# Altium schematic sheet 13-SoC POWER3.SchDoc
size 513 x 386 mm
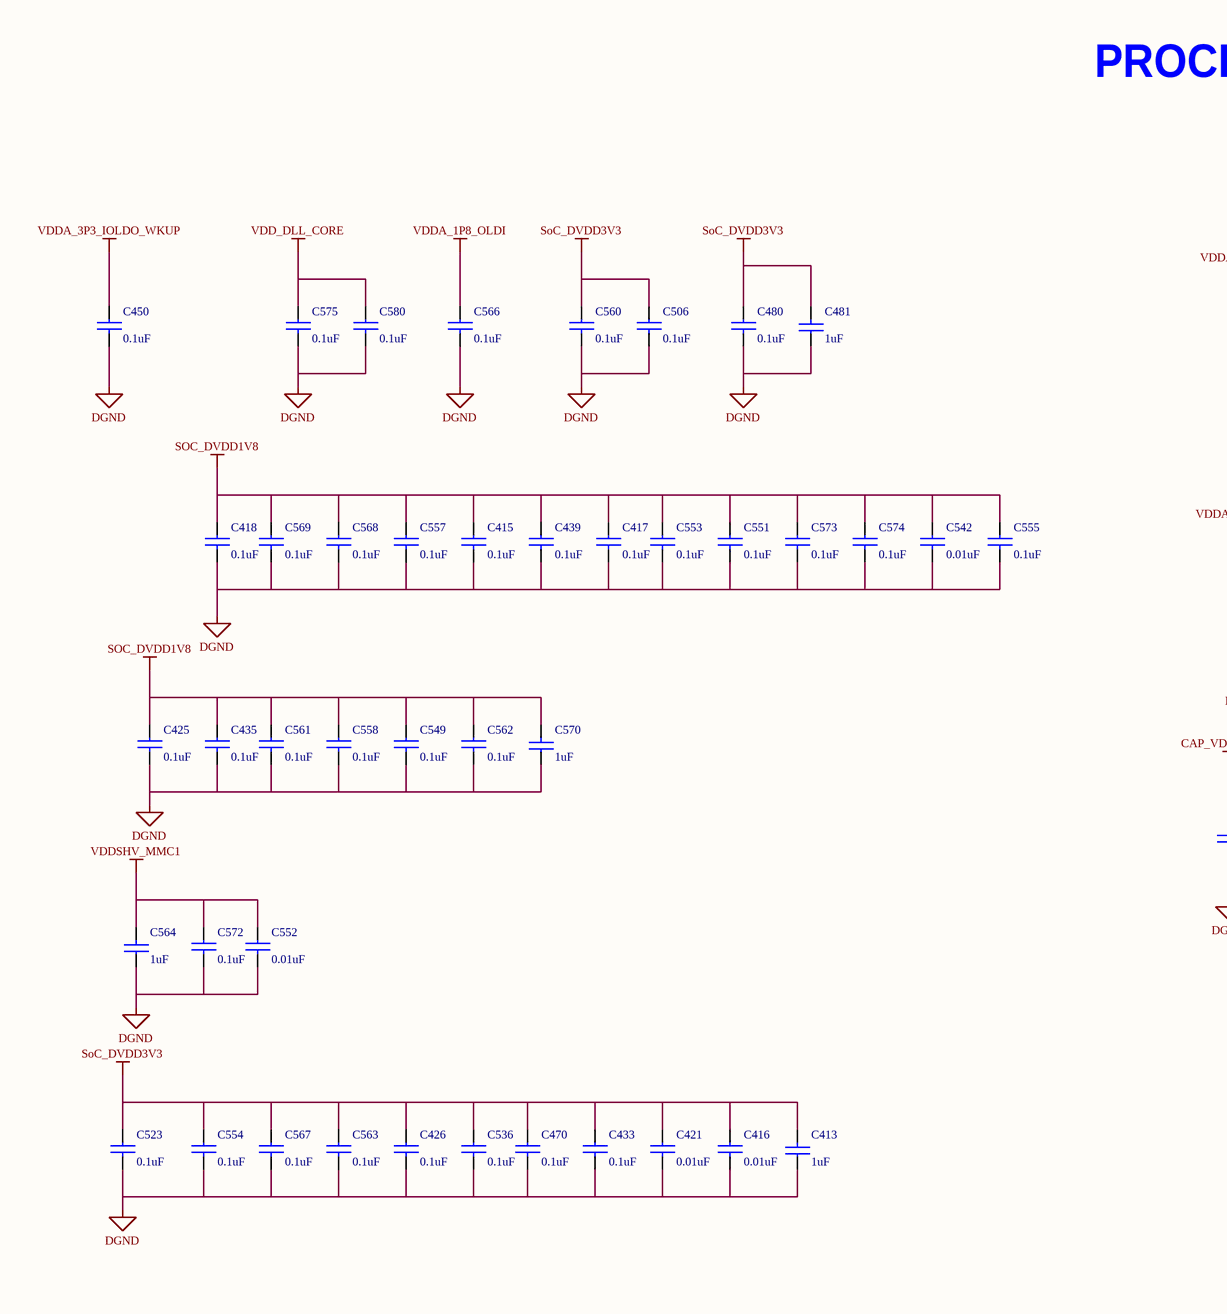
[diagram p0: 13-SoC POWER3.SchDoc, left]
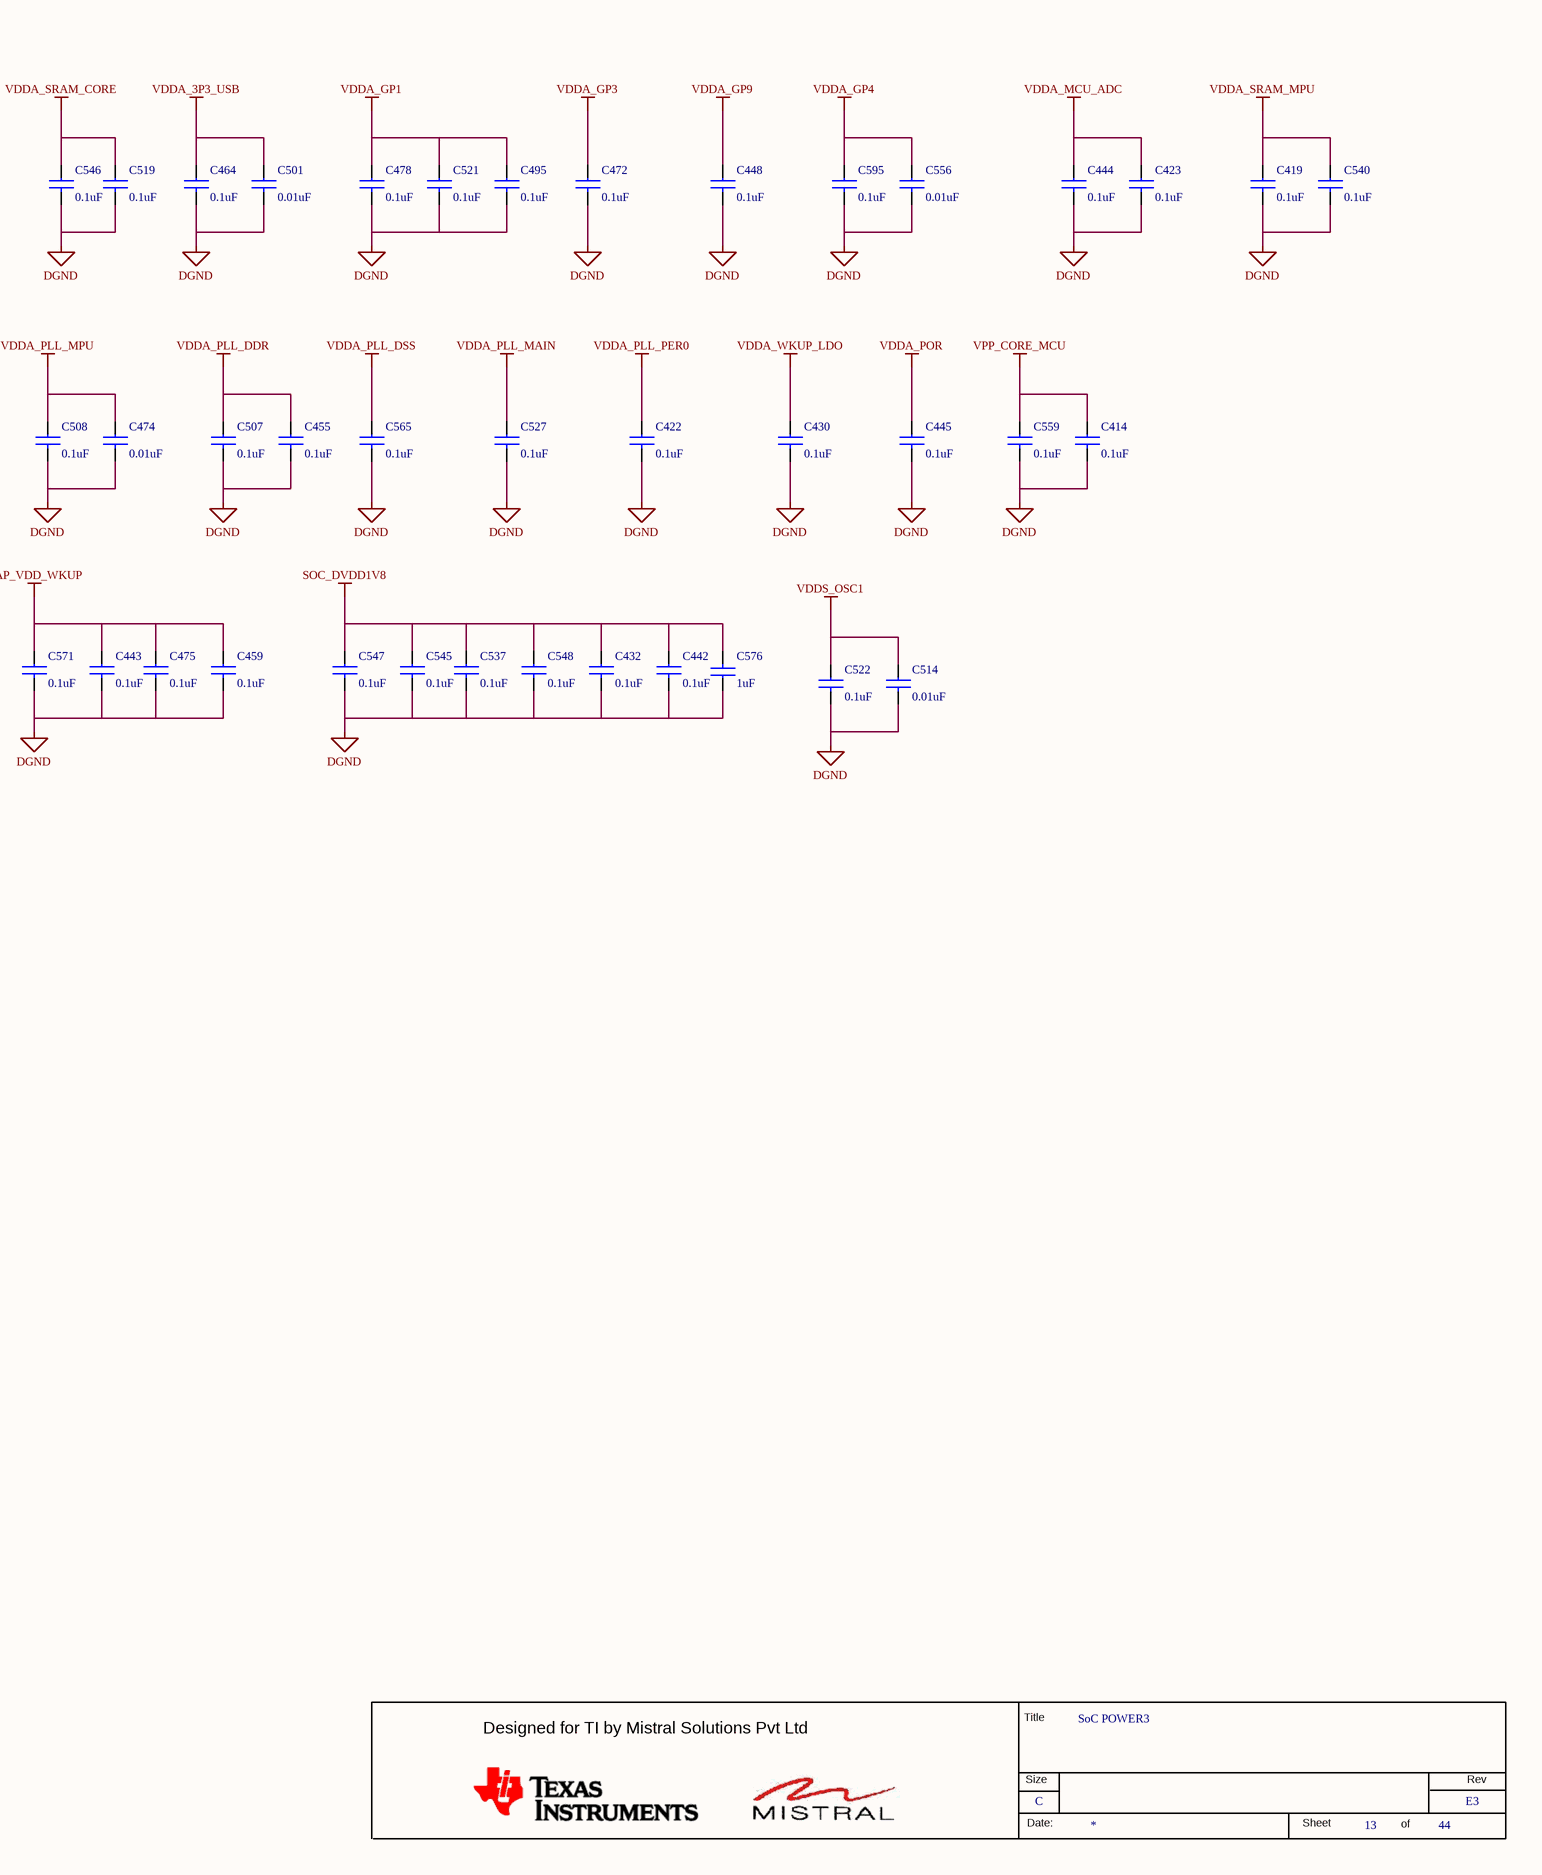
[diagram p1: 13-SoC POWER3.SchDoc, right]

## Parts
*  RevCode: E3  Title: SoC POWER3  Page Size: C  Page Number: 13  Page Count: 44  (hidden comment: MISTRAL_TITLEBLK_CSIZE)  (graphical)
C413  1uF  [CAP0402_0-75]
C414  0.1uF  [CAP0201_0-5]
C415  0.1uF  [CAP0201_0-5]
C416  0.01uF  [CAP0201_0-5]
C417  0.1uF  [CAP0201_0-5]
C418  0.1uF  [CAP0201_0-5]
C419  0.1uF  [CAP0201_0-5]
C421  0.01uF  [CAP0201_0-5]
C422  0.1uF  [CAP0201_0-5]
C423  0.1uF  [CAP0201_0-5]
C425  0.1uF  [CAP0201_0-5]
C426  0.1uF  [CAP0201_0-5]
C430  0.1uF  [CAP0201_0-5]
C432  0.1uF  [CAP0201_0-5]
C433  0.1uF  [CAP0201_0-5]
C435  0.1uF  [CAP0201_0-5]
C439  0.1uF  [CAP0201_0-5]
C442  0.1uF  [CAP0201_0-5]
C443  0.1uF  [CAP0201_0-5]
C444  0.1uF  [CAP0201_0-5]
C445  0.1uF  [CAP0201_0-5]
C448  0.1uF  [CAP0201_0-5]
C450  0.1uF  [CAP0201_0-5]
C455  0.1uF  [CAP0201_0-5]
C459  0.1uF  [CAP0201_0-5]
C464  0.1uF  [CAP0201_0-5]
C470  0.1uF  [CAP0201_0-5]
C472  0.1uF  [CAP0201_0-5]
C474  0.01uF  [CAP0201_0-5]
C475  0.1uF  [CAP0201_0-5]
C478  0.1uF  [CAP0201_0-5]
C480  0.1uF  [CAP0201_0-5]
C481  1uF  [CAP0402_0-75]
C495  0.1uF  [CAP0201_0-5]
C501  0.01uF  [CAP0201_0-5]
C506  0.1uF  [CAP0201_0-5]
C507  0.1uF  [CAP0201_0-5]
C508  0.1uF  [CAP0201_0-5]
C514  0.01uF  [CAP0201_0-5]
C519  0.1uF  [CAP0201_0-5]
C521  0.1uF  [CAP0201_0-5]
C522  0.1uF  [CAP0201_0-5]
C523  0.1uF  [CAP0201_0-5]
C527  0.1uF  [CAP0201_0-5]
C536  0.1uF  [CAP0201_0-5]
C537  0.1uF  [CAP0201_0-5]
C540  0.1uF  [CAP0201_0-5]
C542  0.01uF  [CAP0201_0-5]
C545  0.1uF  [CAP0201_0-5]
C546  0.1uF  [CAP0201_0-5]
C547  0.1uF  [CAP0201_0-5]
C548  0.1uF  [CAP0201_0-5]
C549  0.1uF  [CAP0201_0-5]
C551  0.1uF  [CAP0201_0-5]
C552  0.01uF  [CAP0201_0-5]
C553  0.1uF  [CAP0201_0-5]
C554  0.1uF  [CAP0201_0-5]
C555  0.1uF  [CAP0201_0-5]
C556  0.01uF  [CAP0201_0-5]
C557  0.1uF  [CAP0201_0-5]
C558  0.1uF  [CAP0201_0-5]
C559  0.1uF  [CAP0201_0-5]
C560  0.1uF  [CAP0201_0-5]
C561  0.1uF  [CAP0201_0-5]
C562  0.1uF  [CAP0201_0-5]
C563  0.1uF  [CAP0201_0-5]
C564  1uF  [CAP0402_0-75]
C565  0.1uF  [CAP0201_0-5]
C566  0.1uF  [CAP0201_0-5]
C567  0.1uF  [CAP0201_0-5]
C568  0.1uF  [CAP0201_0-5]
C569  0.1uF  [CAP0201_0-5]
C570  1uF  [CAP0402_0-75]
C571  0.1uF  [CAP0201_0-5]
C572  0.1uF  [CAP0201_0-5]
C573  0.1uF  [CAP0201_0-5]
C574  0.1uF  [CAP0201_0-5]
C575  0.1uF  [CAP0201_0-5]
C576  1uF  [CAP0402_0-75]
C580  0.1uF  [CAP0201_0-5]
C595  0.1uF  [CAP0201_0-5]

## Nets
CAP_VDD_WKUP: C443.1 C459.1 C475.1 C571.1
DGND: C413.1 C414.2 C415.2 C416.2 C417.2 C418.2 C419.2 C421.2 C422.2 C423.2 C425.2 C426.2 C430.2 C432.2 C433.2 C435.2 C439.2 C442.2 C443.2 C444.2 C445.2 C448.2 C450.2 C455.2 C459.2 C464.2 C470.2 C472.2 C474.2 C475.2 C478.2 C480.2 C481.1 C495.2 C501.2 C506.2 C507.2 C508.2 C514.2 C519.2 C521.2 C522.2 C523.2 C527.2 C536.2 C537.2 C540.2 C542.2 C545.2 C546.2 C547.2 C548.2 C549.2 C551.2 C552.2 C553.2 C554.2 C555.2 C556.2 C557.2 C558.2 C559.2 C560.2 C561.2 C562.2 C563.2 C564.1 C565.2 C566.2 C567.2 C568.2 C569.2 C570.1 C571.2 C572.2 C573.2 C574.2 C575.2 C576.1 C580.2 C595.2
SOC_DVDD1V8: C415.1 C417.1 C418.1 C425.1 C432.1 C435.1 C439.1 C442.1 C537.1 C542.1 C545.1 C547.1 C548.1 C549.1 C551.1 C553.1 C555.1 C557.1 C558.1 C561.1 C562.1 C568.1 C569.1 C570.2 C573.1 C574.1 C576.2
SoC_DVDD3V3: C413.2 C416.1 C421.1 C426.1 C433.1 C470.1 C480.1 C481.2 C506.1 C523.1 C536.1 C554.1 C560.1 C563.1 C567.1
VDD_DLL_CORE: C575.1 C580.1
VDDA_1P8_OLDI: C566.1
VDDA_3P3_IOLDO_WKUP: C450.1
VDDA_3P3_USB: C464.1 C501.1
VDDA_GP1: C478.1 C495.1 C521.1
VDDA_GP3: C472.1
VDDA_GP4: C556.1 C595.1
VDDA_GP9: C448.1
VDDA_MCU_ADC: C423.1 C444.1
VDDA_PLL_DDR: C455.1 C507.1
VDDA_PLL_DSS: C565.1
VDDA_PLL_MAIN: C527.1
VDDA_PLL_MPU: C474.1 C508.1
VDDA_PLL_PER0: C422.1
VDDA_POR: C445.1
VDDA_SRAM_CORE: C519.1 C546.1
VDDA_SRAM_MPU: C419.1 C540.1
VDDA_WKUP_LDO: C430.1
VDDS_OSC1: C514.1 C522.1
VDDSHV_MMC1: C552.1 C564.2 C572.1
VPP_CORE_MCU: C414.1 C559.1

## Notes on the sheet
- PROCESSOR DECAPS
- (in symbol MISTRAL_TITLEBLK_CSIZE) Title; Designed for TI by Mistral Solutions Pvt Ltd; Size; Rev; Date:; Sheet; of

## Library data of the parts
* = MISTRAL_TITLEBLK_CSIZE: Issue: 1.0; Page Create Date: March  8, 1995; Page Modify Date: *
C413 C481 C564 = CAP_Dup5: CAP CERAMIC 1uF 16V 20% X5R 0402; Part_type: CAPACITORS\CERAMIC; Mfr_part_number: EMK105BJ105MV-F; Mfr_name: TAIYO YUDEN; Mistral Part No: 120018020006-R; Custom_Duty: 15%; Customs_HS_Code: 85322990; Wattage: NA; Project: TI_MAXIE_CPB; Footprint Path: Y:\MIS_DATABASE\Library\ALTIUM_TOOL\PCB_FOOTPRINTS\Altium_Footprint_Lib.PcbLib; Library Path: Y:\MIS_DATABASE\Library\ALTIUM_TOOL\SCHEMATICS_PARTS\MS_DISCRETE_Library.schlib; MECHANICAL 3D STEP FILE: CAP0402_0-75; PCB Footprint: CAP0402_0-75; Chkd/date: MANIRAJA/150218; Crtd /date: ALVY/150218; Datasheet: Y:\MIS_DATABASE\DATASHEETS\CAPACITORS\EMK105BJ105MV-F.PDF; Temperature: -55°C+85°C; Weight: 0.65mg; Height: 0.55MM; Distributor_part_number: 587-5514-1-ND; Distributor_name: DIGIKEY; Package: 0402; Voltage: 16V; Tolerance: 20%; Library Ref: CAP; Footprint Ref: CAP0402_0-75
C414 C415 C418 C422 C423 C425 C432 C433 C439 C442 C448 C450 C459 C464 C472 C480 C506-C508 C519 C521 C522 C527 C536 C537 C540 C545 C553 C558 C562 C566-C568 C571-C573 C580 = CAP_Dup5: CAP CERAMIC 0.1uF 16V 10% X5R 0201; Mistral Part No: 120009030072-R; Mfr_name: MURATA; Mfr_part_number: GRM033R61C104KE84J; Part_type: CAPACITORS\CERAMIC; Project: TI_MAXIE_CPB; Wattage: NA; Customs_HS_Code: 85322990; Custom_Duty: 15%; PCB Footprint: CAP0201_0-5; Tolerance: 10%; Voltage: 16V; Package: 0201; Distributor_name: DIGIKEY; Distributor_part_number: 490-16742-1-ND; Height: 0.33MM; Weight: 0.33mg; Temperature: -55°C+85°C; Datasheet: Y:\MIS_DATABASE\DATASHEETS\CAPACITORS\GRM033R61C104KE84.PDF; Crtd /date: MANIRAJA/120218; Chkd/date: MANIRAJA/120218; MECHANICAL 3D STEP FILE: CAP0201_0-5; Library Ref: CAP
C416 C421 C556 = CAP_Dup5: CAP CERAMIC 0.01uF 25V 10% X5R 0201; Part_type: CAPACITORS\CERAMIC; Mfr_part_number: GRM033R61E103KA12J; Mfr_name: MURATA; Mistral Part No: 120018010007-R; Custom_Duty: 15%; Customs_HS_Code: 85322990; Project: TI_MAXIE_CPB; Wattage: NA; PCB Footprint: CAP0201_0-5; Chkd/date: MANIRAJA/230118; Crtd /date: MANIRAJA/230118; Datasheet: Y:\MIS_DATABASE\DATASHEETS\CAPACITORS\GRM033R61E103KA12.PDF; Height: 0.33MM; Distributor_part_number: GRM033R61E103KA12J-ND; Distributor_name: DIGIKEY; Package: 0201; Voltage: 25V; Tolerance: 10%; Weight: 0.33mg; Temperature: -55°C+85°C; MECHANICAL 3D STEP FILE: CAP0201_0-5; Library Ref: CAP
C417 C419 C426 C430 C435 C443-C445 C455 C470 C475 C478 C495 C523 C546-C549 C551 C554 C555 C557 C559-C561 C563 C565 C569 C574 C575 C595 = CAP_Dup5: CAP CERAMIC 0.1uF 16V 10% X5R 0201; Part_type: CAPACITORS\CERAMIC; Mfr_part_number: GRM033R61C104KE84J; Mfr_name: MURATA; Mistral Part No: 120009030072-R; Custom_Duty: 15%; Customs_HS_Code: 85322990; Wattage: NA; Project: TI_MAXIE_CPB; PCB Footprint: CAP0201_0-5; MECHANICAL 3D STEP FILE: CAP0201_0-5; Chkd/date: MANIRAJA/120218; Crtd /date: MANIRAJA/120218; Datasheet: Y:\MIS_DATABASE\DATASHEETS\CAPACITORS\GRM033R61C104KE84.PDF; Temperature: -55°C+85°C; Weight: 0.33mg; Height: 0.33MM; Distributor_part_number: 490-16742-1-ND; Distributor_name: DIGIKEY; Package: 0201; Voltage: 16V; Tolerance: 10%; Library Ref: CAP
C474 C501 C514 C542 C552 = CAP_Dup5: CAP CERAMIC 0.01uF 25V 10% X5R 0201; Mistral Part No: 120018010007-R; Mfr_name: MURATA; Mfr_part_number: GRM033R61E103KA12J; Part_type: CAPACITORS\CERAMIC; Wattage: NA; Project: TI_MAXIE_CPB; Customs_HS_Code: 85322990; Custom_Duty: 15%; PCB Footprint: CAP0201_0-5; MECHANICAL 3D STEP FILE: CAP0201_0-5; Temperature: -55°C+85°C; Weight: 0.33mg; Tolerance: 10%; Voltage: 25V; Package: 0201; Distributor_name: DIGIKEY; Distributor_part_number: GRM033R61E103KA12J-ND; Height: 0.33MM; Datasheet: Y:\MIS_DATABASE\DATASHEETS\CAPACITORS\GRM033R61E103KA12.PDF; Crtd /date: MANIRAJA/230118; Chkd/date: MANIRAJA/230118; Library Ref: CAP
C570 C576 = CAP_Dup5: CAP CERAMIC 1uF 16V 20% X5R 0402; Mistral Part No: 120018020006-R; Mfr_name: TAIYO YUDEN; Mfr_part_number: EMK105BJ105MV-F; Part_type: CAPACITORS\CERAMIC; Project: TI_MAXIE_CPB; Wattage: NA; Customs_HS_Code: 85322990; Custom_Duty: 15%; Footprint Path: Y:\MIS_DATABASE\Library\ALTIUM_TOOL\PCB_FOOTPRINTS\Altium_Footprint_Lib.PcbLib; Library Path: Y:\MIS_DATABASE\Library\ALTIUM_TOOL\SCHEMATICS_PARTS\MS_DISCRETE_Library.schlib; MECHANICAL 3D STEP FILE: CAP0402_0-75; PCB Footprint: CAP0402_0-75; Tolerance: 20%; Voltage: 16V; Package: 0402; Distributor_name: DIGIKEY; Distributor_part_number: 587-5514-1-ND; Height: 0.55MM; Weight: 0.65mg; Temperature: -55°C+85°C; Datasheet: Y:\MIS_DATABASE\DATASHEETS\CAPACITORS\EMK105BJ105MV-F.PDF; Crtd /date: ALVY/150218; Chkd/date: MANIRAJA/150218; Library Ref: CAP; Footprint Ref: CAP0402_0-75